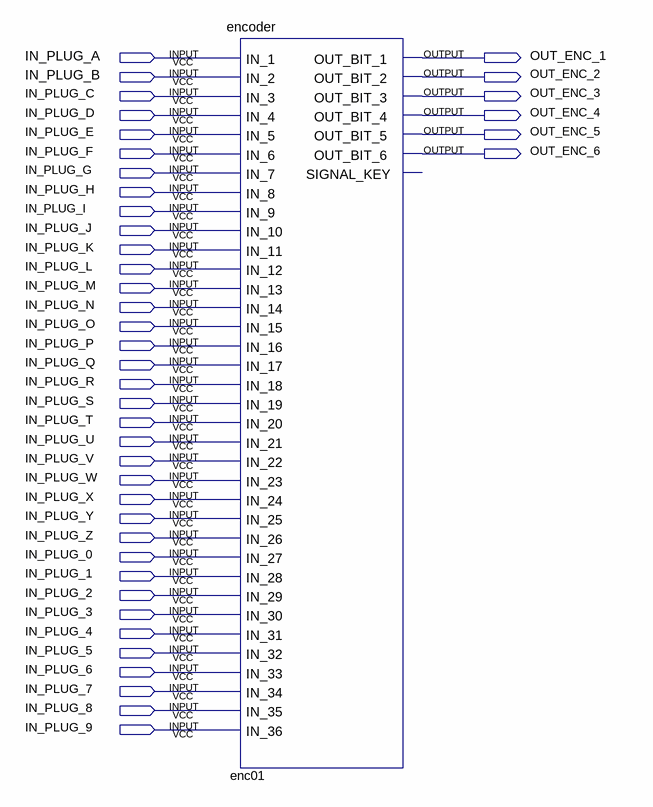
[diagram p0: schematic sheet]
// Quartus schematic plugboard-controller.bdf as structural Verilog: 1 symbols, 42 pins
module \plugboard-controller  (
  input  IN_PLUG_A,
  input  IN_PLUG_B,
  input  IN_PLUG_C,
  input  IN_PLUG_D,
  input  IN_PLUG_E,
  input  IN_PLUG_F,
  input  IN_PLUG_G,
  input  IN_PLUG_H,
  input  IN_PLUG_I,
  input  IN_PLUG_J,
  input  IN_PLUG_K,
  input  IN_PLUG_L,
  input  IN_PLUG_M,
  input  IN_PLUG_N,
  input  IN_PLUG_O,
  input  IN_PLUG_P,
  input  IN_PLUG_Q,
  input  IN_PLUG_R,
  input  IN_PLUG_S,
  input  IN_PLUG_T,
  input  IN_PLUG_U,
  input  IN_PLUG_V,
  input  IN_PLUG_W,
  input  IN_PLUG_X,
  input  IN_PLUG_Y,
  input  IN_PLUG_Z,
  input  IN_PLUG_0,
  input  IN_PLUG_1,
  input  IN_PLUG_2,
  input  IN_PLUG_3,
  input  IN_PLUG_4,
  input  IN_PLUG_5,
  input  IN_PLUG_6,
  input  IN_PLUG_7,
  input  IN_PLUG_8,
  input  IN_PLUG_9,
  output OUT_ENC_1,
  output OUT_ENC_2,
  output OUT_ENC_3,
  output OUT_ENC_4,
  output OUT_ENC_5,
  output OUT_ENC_6
);

  encoder enc01 (
    .IN_1(IN_PLUG_A), .IN_2(IN_PLUG_B), .IN_3(IN_PLUG_C), .IN_4(IN_PLUG_D), .IN_5(IN_PLUG_E),
    .IN_6(IN_PLUG_F), .IN_7(IN_PLUG_G), .IN_8(IN_PLUG_H), .IN_9(IN_PLUG_I), .IN_10(IN_PLUG_J),
    .IN_11(IN_PLUG_K), .IN_12(IN_PLUG_L), .IN_13(IN_PLUG_M), .IN_14(IN_PLUG_N), .IN_15(IN_PLUG_O),
    .IN_16(IN_PLUG_P), .IN_17(IN_PLUG_Q), .IN_18(IN_PLUG_R), .IN_19(IN_PLUG_S), .IN_20(IN_PLUG_T),
    .IN_21(IN_PLUG_U), .IN_22(IN_PLUG_V), .IN_23(IN_PLUG_W), .IN_24(IN_PLUG_X), .IN_25(IN_PLUG_Y),
    .IN_26(IN_PLUG_Z), .IN_27(IN_PLUG_0), .IN_28(IN_PLUG_1), .IN_29(IN_PLUG_2), .IN_30(IN_PLUG_3),
    .IN_31(IN_PLUG_4), .IN_32(IN_PLUG_5), .IN_33(IN_PLUG_6), .IN_34(IN_PLUG_7), .IN_35(IN_PLUG_8),
    .IN_36(IN_PLUG_9), .OUT_BIT_1(OUT_ENC_1), .OUT_BIT_2(OUT_ENC_2), .OUT_BIT_3(OUT_ENC_3),
    .OUT_BIT_4(OUT_ENC_4), .OUT_BIT_5(OUT_ENC_5), .OUT_BIT_6(OUT_ENC_6));  // open: SIGNAL_KEY
endmodule
